# Altium schematic sheet backplane_ethernet.SchDoc
size A; SheetNumber: 2; SheetTotal: 3
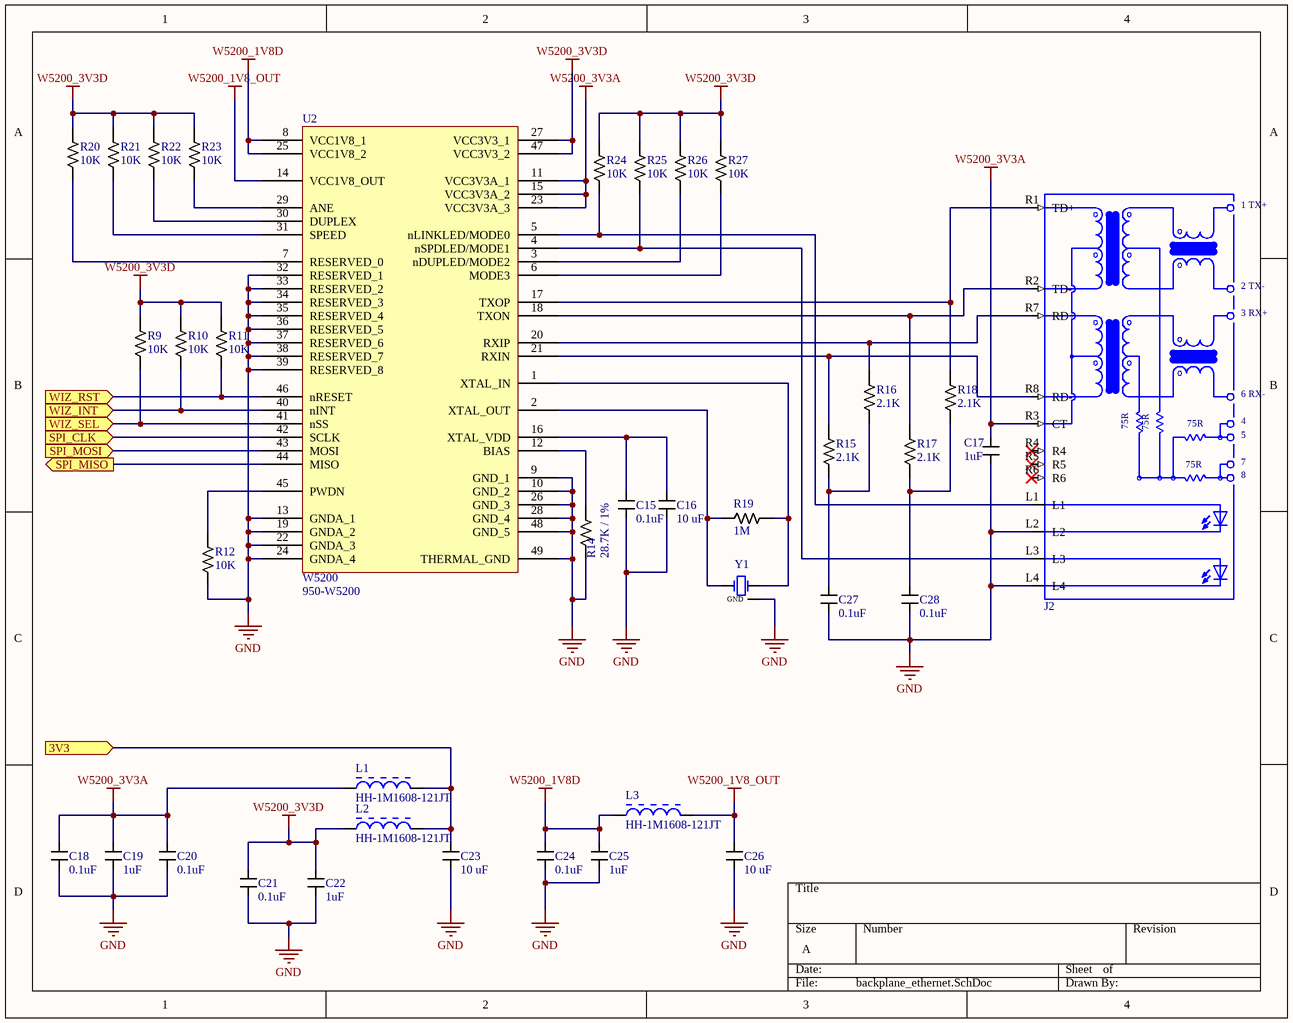
[diagram p0: backplane_ethernet.SchDoc]

## Parts
C15  value 0.1uF  [CAPACITOR_0603]  (hidden comment: 100nF Ceramic 6.3V)
C16  Value (uF): 10 uF  [CAPACITOR_0603]  (hidden comment: 10uF Ceramic 6.3V)
C17  value 1uF  [CAPACITOR_0603]  (hidden comment: 1uF Ceramic 16V)
C18  value 0.1uF  [CAPACITOR_0603]  (hidden comment: 100nF Ceramic 6.3V)
C19  value 1uF  [CAPACITOR_0603]  (hidden comment: 1uF Ceramic 16V)
C20  value 0.1uF  [CAPACITOR_0603]  (hidden comment: 100nF Ceramic 6.3V)
C21  value 0.1uF  [CAPACITOR_0603]  (hidden comment: 100nF Ceramic 6.3V)
C22  value 1uF  [CAPACITOR_0603]  (hidden comment: 1uF Ceramic 16V)
C23  Value (uF): 10 uF  [CAPACITOR_0603]  (hidden comment: 10uF Ceramic 6.3V)
C24  value 0.1uF  [CAPACITOR_0603]  (hidden comment: 100nF Ceramic 6.3V)
C25  value 1uF  [CAPACITOR_0603]  (hidden comment: 1uF Ceramic 16V)
C26  Value (uF): 10 uF  [CAPACITOR_0603]  (hidden comment: 10uF Ceramic 6.3V)
C27  value 0.1uF  [CAPACITOR_0603]  (hidden comment: 100nF Ceramic 6.3V)
C28  value 0.1uF  [CAPACITOR_0603]  (hidden comment: 100nF Ceramic 6.3V)
J2  Ethernet Connector  [WIZNET_RB1-125BAG1A]  (value not drawn)
L1  HH-1M1608-121JT  [CTC-1608_L]
L2  HH-1M1608-121JT  [CTC-1608_L]
L3  HH-1M1608-121JT  [CTC-1608_L]
R9  Value  (Ohms): 10K  [RESISTOR_0603]  (hidden comment: 10k Ohm 5% 1/10W)
R10  Value  (Ohms): 10K  [RESISTOR_0603]  (hidden comment: 10k Ohm 5% 1/10W)
R11  Value  (Ohms): 10K  [RESISTOR_0603]  (hidden comment: 10k Ohm 5% 1/10W)
R12  Value  (Ohms): 10K  [RESISTOR_0603]  (hidden comment: 10k Ohm 5% 1/10W)
R14  Value  (Ohms): 28.7K / 1%  [RESISTOR_0603]  (hidden comment: K / 1%)
R15  Value  (Ohms): 2.1K  [RESISTOR_0603]  (hidden comment: 2.1k Ohm 5% 1/8W)
R16  Value  (Ohms): 2.1K  [RESISTOR_0603]  (hidden comment: 2.1k Ohm 5% 1/8W)
R17  Value  (Ohms): 2.1K  [RESISTOR_0603]  (hidden comment: 2.1k Ohm 5% 1/8W)
R18  Value  (Ohms): 2.1K  [RESISTOR_0603]  (hidden comment: 2.1k Ohm 5% 1/8W)
R19  1M  [RESISTOR_0603]
R20  Value  (Ohms): 10K  [RESISTOR_0603]  (hidden comment: 10k Ohm 5% 1/10W)
R21  Value  (Ohms): 10K  [RESISTOR_0603]  (hidden comment: 10k Ohm 5% 1/10W)
R22  Value  (Ohms): 10K  [RESISTOR_0603]  (hidden comment: 10k Ohm 5% 1/10W)
R23  Value  (Ohms): 10K  [RESISTOR_0603]  (hidden comment: 10k Ohm 5% 1/10W)
R24  Value  (Ohms): 10K  [RESISTOR_0603]  (hidden comment: 10k Ohm 5% 1/10W)
R25  Value  (Ohms): 10K  [RESISTOR_0603]  (hidden comment: 10k Ohm 5% 1/10W)
R26  Value  (Ohms): 10K  [RESISTOR_0603]  (hidden comment: 10k Ohm 5% 1/10W)
R27  Value  (Ohms): 10K  [RESISTOR_0603]  (hidden comment: 10k Ohm 5% 1/10W)
U2  W5200  Supplier Part Number 1: 950-W5200  [QFN-48]
Y1  CRYSTAL 25.0000MHZ 18PF SMD  [4-SMD No Lead Crystal]  (value not drawn)

## Ports
3V3 (in), SPI_CLK (in), SPI_MISO (out), SPI_MOSI (in), WIZ_INT (in), WIZ_RST (in), WIZ_SEL (in)

## Nets
GND: C15.2 C16.2 C17.2 C18.2 C19.2 C20.2 C21.2 C22.2 C23.2 C24.2 C25.2 C26.2 C27.2 C28.2 J2.L2 J2.L4 R12.2 R14.2 U2.9(GND_1) U2.10(GND_2) U2.13(GNDA_1) U2.19(GNDA_2) U2.22(GNDA_3) U2.24(GNDA_4) U2.26(GND_3) U2.28(GND_4) U2.32(RESERVED_1) U2.33(RESERVED_2) U2.34(RESERVED_3) U2.35(RESERVED_4) U2.36(RESERVED_5) U2.37(RESERVED_6) U2.38(RESERVED_7) U2.39(RESERVED_8) U2.48(GND_5) U2.49(THERMAL_GND) Y1.GND
W5200_1V8_OUT: C26.1 L3.2 U2.14(VCC1V8_OUT)
W5200_1V8D: C24.1 C25.1 L3.1 U2.8(VCC1V8_1) U2.25(VCC1V8_2)
W5200_3V3A: C17.1 C18.1 C19.1 C20.1 J2.R3(CT) L1.1 U2.11(VCC3V3A_1) U2.15(VCC3V3A_2) U2.23(VCC3V3A_3)
W5200_3V3D: C21.1 C22.1 L2.1 R9.1 R10.1 R11.1 R20.1 R21.1 R22.1 R23.1 R24.1 R25.1 R26.1 R27.1 U2.27(VCC3V3_1) U2.47(VCC3V3_2)
3V3: C23.1 L1.2 L2.2 ; port 3V3
SPI_CLK: U2.42(SCLK) ; port SPI_CLK
SPI_MISO: U2.44(MISO) ; port SPI_MISO
SPI_MOSI: U2.43(MOSI) ; port SPI_MOSI
WIZ_INT: R10.2 U2.40(nINT) ; port WIZ_INT
WIZ_RST: R11.2 U2.46(nRESET) ; port WIZ_RST
WIZ_SEL: R9.2 U2.41(nSS) ; port WIZ_SEL
NetC15_1: C15.1 C16.1 U2.16(XTAL_VDD)
NetC27_1: C27.1 R15.2 R16.2
NetC28_1: C28.1 R17.2 R18.2
NetJ2_L1: J2.L1 R24.2 U2.5(nLINKLED/MODE0)
NetJ2_L3: J2.L3 R25.2 U2.4(nSPDLED/MODE1)
NetJ2_R1: J2.R1(TD+) R18.1 U2.17(TXOP)
NetJ2_R2: J2.R2(TD-) R17.1 U2.18(TXON)
NetJ2_R7: J2.R7(RD+) R16.1 U2.20(RXIP)
NetJ2_R8: J2.R8(RD-) R15.1 U2.21(RXIN)
NetR12_1: R12.1 U2.45(PWDN)
NetR14_1: R14.1 U2.12(BIAS)
NetR19_1: R19.1 U2.1(XTAL_IN) Y1.2
NetR19_2: R19.2 U2.2(XTAL_OUT) Y1.1
NetR20_2: R20.2 U2.7(RESERVED_0)
NetR21_2: R21.2 U2.31(SPEED)
NetR22_2: R22.2 U2.30(DUPLEX)
NetR23_2: R23.2 U2.29(ANE)
NetR26_2: R26.2 U2.3(nDUPLED/MODE2)
NetR27_2: R27.2 U2.6(MODE3)

Not connected (* = marked no-connect by the designer): J2 R4* R5* R6*

## Notes on the sheet
- (in symbol RB1-125BAG1A) 1 TX+; 2 TX-; 3 RX+; 6 RX-; 75R; 4; 5; 7; 8

## Library data of the parts
C15 C18 C20 C21 C24 C27 C28 = CAPACITOR_0.1uF_0603: Cap 100nF 6.3V +/-10% / Ceramic 0603; Made By: Flip B; ComponentLink1Description: Datsheet; ComponentLink1URL: https://www.mouser.com/datasheet/2/212/KEM_C1002_X7R_SMD-1102033.pdf; Tolerance: +/- 10%; Voltage: 6.3V; Supplier 1: Digi-Key; Supplier Part Number 1: 399-15351-1-ND
C16 C23 C26 = CAPACITOR_10uF_0603: Cap 10uF 6.3V +/-20% / Ceramic 0603; Made By: Flip B; ComponentLink1Description: Digikey; ComponentLink1URL: https://www.digikey.com/en/products/detail/samsung-electro-mechanics/CL10A106MQ8NNNC/3886777; Supplier 1: Digi-Key; Supplier Part Number 1: 1276-1119-1-ND; Tolerance: +/- 20%; Voltage: 6.3V
C17 C19 C22 C25 = CAPACITOR_1uF_0603: Cap 1uF 16V +/-10% / Ceramic 0603; Made By: Flip B; Tolerance: +/- 10%; Voltage: 16V; Supplier 1: Digi-Key; Supplier Part Number 1: 399-7847-1-ND
J2 = RB1-125BAG1A: CONN JACK 1PORT 100 BASE-T PCB
L1-L3 = CMP-2000-06403-1: Chip Ferrite Bead, 0.14 Ohm, 1.1 A, -55 to 125 degC, 2-Pin SMD, RoHS, Tape and Reel; Manufacturer: CTC Coils; DC Resistance Max: 140MOhm; DC Current Max: 1.1A; Datasheet Version: 07/2004; Datasheet URL: http://data.icbank.com/ICBShop/board/beadhbm.pdf; PartNumber: HH-1M1608; Package Reference: 1608; Temperature Min: -55degC; Manufacturer URL: http://www.brokerforum.com/components-parts/CTCCoils-e-en.jsa; Mounting Technology: SurfaceMount; Temperature Max: 125degC; Package Description: 2-Pin Surface Mount Device, Body 1.6 x 0.8 mm; Packing: TapeandReel
R9-R12 R20-R27 = RESISTOR_10K_0603: RES 10k OHM 5% 1/10W 0603; Tolerance: +/- 5%; Wattage: 1/8W; Made By: Robert Pafford; ComponentLink1Description: Datasheet; ComponentLink1URL: https://www.bourns.com/docs/product-datasheets/CRxxxxx.pdf; Supplier: Digikey; Digikey Part Numer: CR0603-JW-104ELFTR-ND; Supplier 1: Digi-Key; Supplier Part Number 1: 2019-RK73B1JTTD103JCT-ND
R14 = RESISTOR_28.7K / 1%_0603_1: RES 28.7K OHM 1% 1/8W 0603; Tolerance: +/- 5%; Made By: Robert Pafford; ComponentLink1Description: Datasheet; ComponentLink1URL: https://www.bourns.com/docs/product-datasheets/CRxxxxx.pdf; Wattage: 1/8W; Supplier: Digikey; Digikey Part Numer: CR0603-JW-104ELFTR-ND; Supplier 1: Digi-Key; Supplier Part Number 1: 541-28.7KHCT-ND
R15-R18 = RESISTOR_2.1K_0603_1: RES 2.1k OHM 5% 1/8W 0603; Tolerance: +/- 5%; Made By: Robert Pafford; ComponentLink1Description: Datasheet; ComponentLink1URL: https://www.bourns.com/docs/product-datasheets/CRxxxxx.pdf; Wattage: 1/8W; Supplier: Digikey; Digikey Part Numer: CR0603-JW-104ELFTR-ND; Supplier 1: Digi-Key; Supplier Part Number 1: YAG1852CT-ND
R19 = RESISTOR_1M_0603_1: RES 1M OHM 1/8W 0603; Tolerance: +/- 5%; Made By: Robert Pafford; ComponentLink1Description: Datasheet; ComponentLink1URL: https://www.bourns.com/docs/product-datasheets/CRxxxxx.pdf; Wattage: 1/8W; Supplier: Digikey; Digikey Part Numer: CR0603-JW-104ELFTR-ND; Supplier 1: Digi-Key; Supplier Part Number 1: RMCF0603JT1M00CT-ND; Value  (Ohms): 1M
U2 = W5200: WIZNET W5200 / 48QFN (7x7 mm); MF: Texas Instruments; MP: LM1117IMPX-3.3/NOPB; Created by:: Siddharth.V; Texas_Instruments-Purchase-URL: https://snapeda.com/shop?store=Texas+Instruments&id=410186; Price: None; Mouser-Purchase-URL: https://snapeda.com/shop?store=Mouser&id=410186; Value: *; Availability: Good; Package: SOT-223-4 Texas Instruments; Arrow_Electronics-Purchase-URL: https://snapeda.com/shop?store=Arrow+Electronics&id=410186; SnapEDA_Link: https://www.snapeda.com/parts/LM1117IMPX-3.3/NOPB/Texas%20Instruments/view-part/410186/?ref=snap; DigiKey-Purchase-URL: https://snapeda.com/shop?store=DigiKey&id=410186; ComponentLink1Description: Datasheet; ComponentLink1URL: https://www.wiznet.io/product-item/w5200/; Supplier 1: Mouser
Y1 = CRYSTAL_25MHz_SMD_1: 25 MHz ±20ppm Crystal 18pF; pin to pad: 2>3 GND>2+4; Made By: Robert Pafford; Frequency: 12 MHz; ESR: 50 Ohmz; Load Capacitance: 18pF; Supplier 1: Digi-Key; Supplier Part Number 1: 2151-AS-25.000-18-F-EXT-ND